# EAGLE design fabftdi-mega8 (EAGLE 8.2.2)
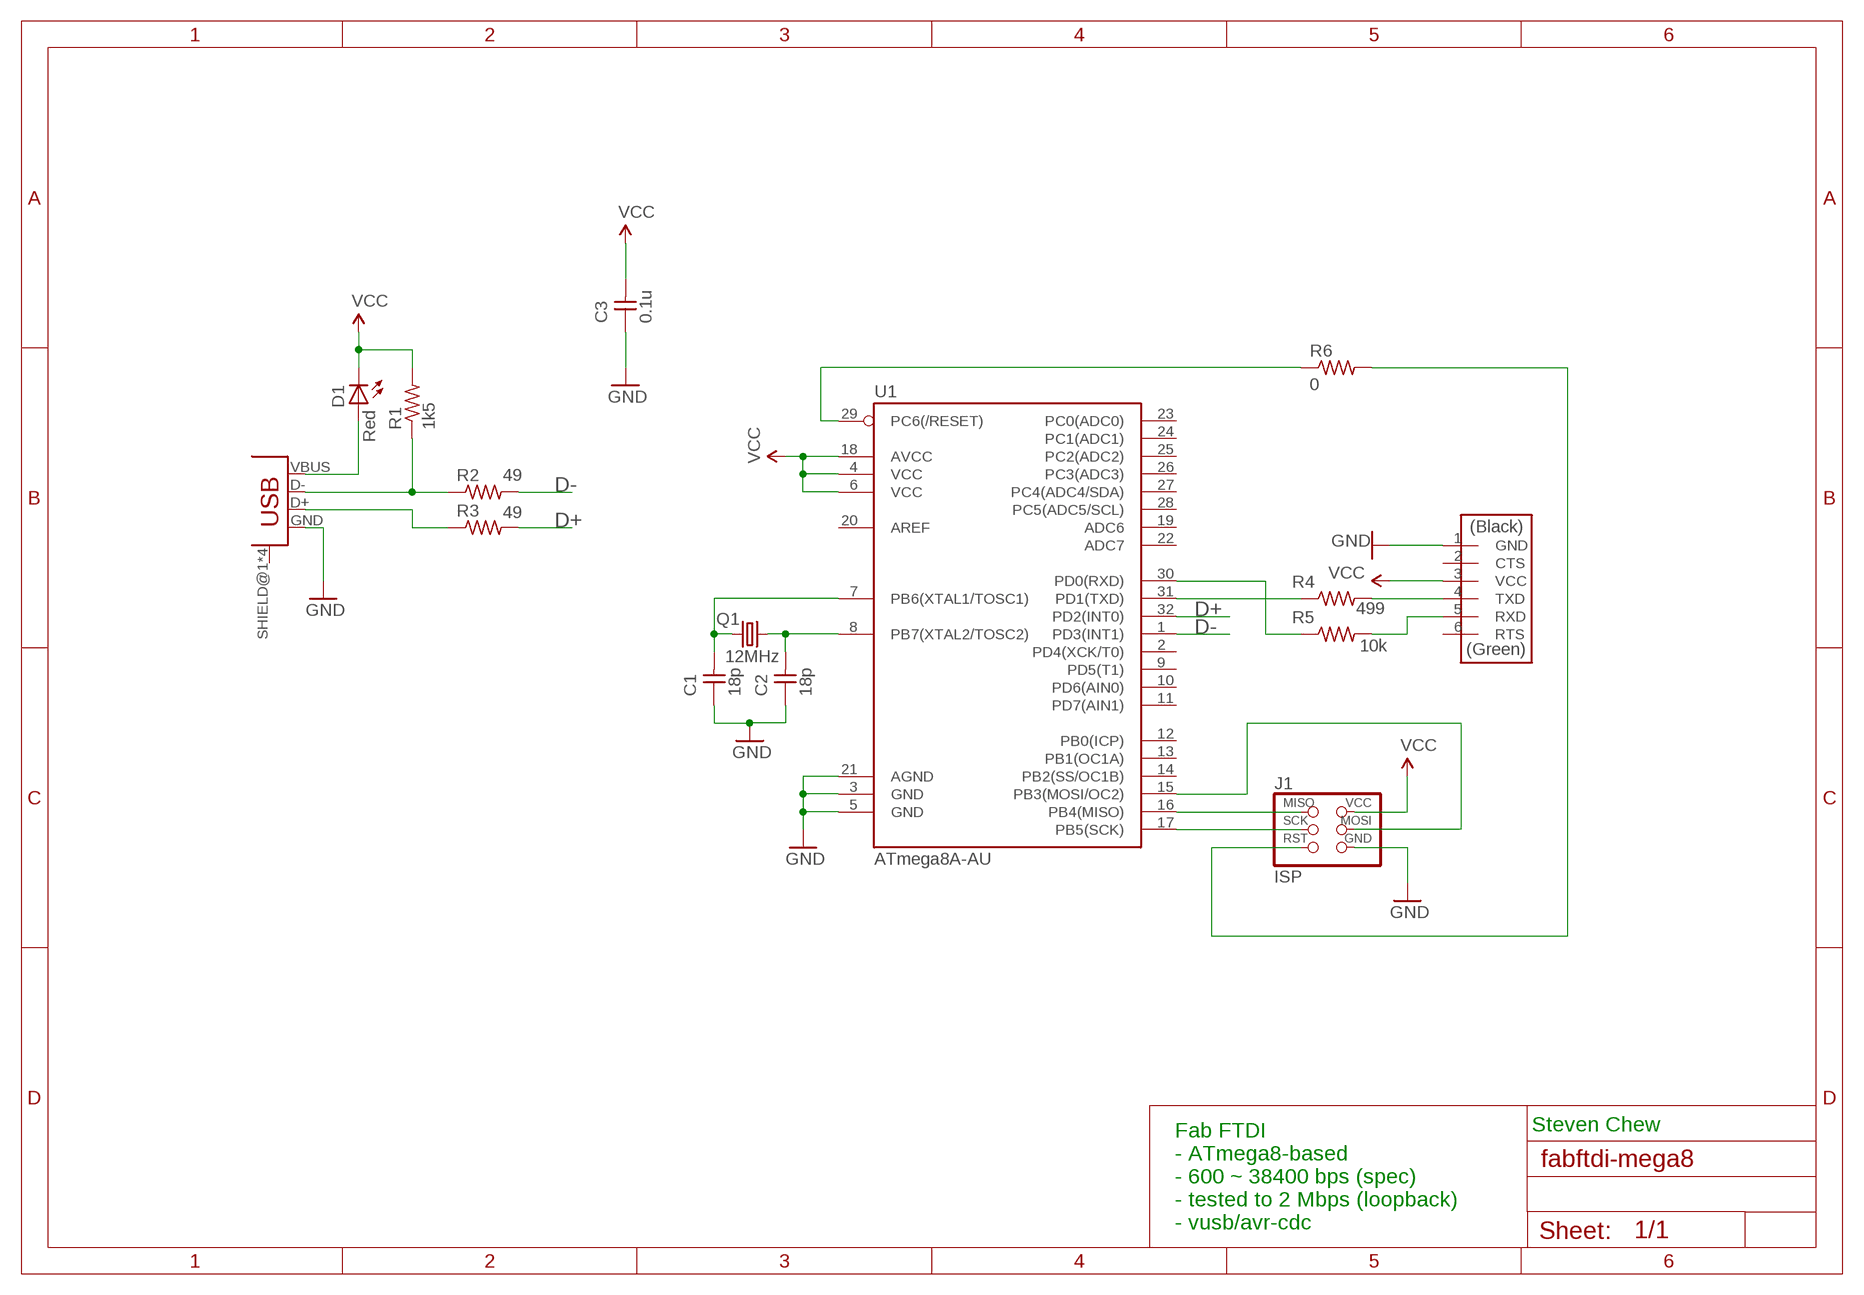
[diagram p0: schematic, sheet 1]

## Parts
C1  18p  CAP-UNPOLARIZEDFAB  [C1206FAB]
C2  18p  CAP-UNPOLARIZEDFAB  [C1206FAB]
C3  0.1u  CAP-UNPOLARIZEDFAB  [C1206FAB]
D1  Red  LEDFAB1206  [LED1206FAB]
J1  ISP  AVRISPSMD  [2X03SMD]
J2  FTDI-SMD-HEADER  [1X06SMD]
Q1  12MHz  CRYSTALHC49UP  [HC49UP]
R1  1k5  RES-US1206FAB  [R1206FAB]
R2  49  RES-US1206FAB  [R1206FAB]
R3  49  RES-US1206FAB  [R1206FAB]
R4  499  RES-US1206FAB  [R1206FAB]
R5  10k  RES-US1206FAB  [R1206FAB]
R6  0  RES-US1206FAB  [R1206FAB]
U1  ATmega8A-AU  ATMEGA328P_TQFPTQFP32-08THIN  [TQFP32-08THIN]
U2  USB_MINI  [USB_MINI]

## Nets
D+: R3.2 U1.32(PD2(INT0))
D-: R2.2 U1.1(PD3(INT1))
GND: C1.1 C2.1 C3.1 J1.6(GND) J2.1(GND) U1.3(GND) U1.5(GND) U1.21(AGND) U2.GND
N$1: C2.2 Q1.2 U1.8(PB7(XTAL2/TOSC2))
N$2: C1.2 Q1.1 U1.7(PB6(XTAL1/TOSC1))
N$3: R4.1 U1.31(PD1(TXD))
N$4: R5.1 U1.30(PD0(RXD))
N$5: J1.1(MISO) U1.16(PB4(MISO))
N$6: D1.1(A) U2.VBUS
N$7: R1.1 R2.1 U2.D-
N$8: R3.1 U2.D+
N$9: J1.3(SCK) U1.17(PB5(SCK))
N$10: J1.4(MOSI) U1.15(PB3(MOSI/OC2))
N$11: J2.4(TXD) R4.2
N$12: J1.5(RST) R6.2
N$13: R6.1 U1.29(PC6(/RESET))
N$14: J2.5(RXD) R5.2
VCC: C3.2 D1.2(C) J1.2(VCC) J2.3(VCC) R1.2 U1.4(VCC) U1.6(VCC) U1.18(AVCC)
Unconnected: J2.2(CTS) J2.6(RTS) U1.2(PD4(XCK/T0)) U1.9(PD5(T1)) U1.10(PD6(AIN0)) U1.11(PD7(AIN1)) U1.12(PB0(ICP)) U1.13(PB1(OC1A)) U1.14(PB2(SS/OC1B)) U1.19(ADC6) U1.20(AREF) U1.22(ADC7) U1.23(PC0(ADC0)) U1.24(PC1(ADC1)) U1.25(PC2(ADC2)) U1.26(PC3(ADC3)) U1.27(PC4(ADC4/SDA)) U1.28(PC5(ADC5/SCL)) U2.SHIELD@1(SHIELD) U2.SHIELD@2(SHIELD) U2.SHIELD@3(SHIELD) U2.SHIELD@4(SHIELD)

## Notes on the sheet
- Steven Chew
- Fab FTDI
  - ATmega8-based
  - 600 ~ 38400 bps (spec)
  - tested to 2 Mbps (loopback)
  - vusb/avr-cdc

## Library data of the parts
C1-C3 = 00fab:CAP-UNPOLARIZED
D1 = 00fab:LED: LED
J1 = 00fab:AVRISP
J2 = 00fab:FTDI-SMD-HEADER
Q1 = crystal:CRYSTAL: CRYSTAL; OC_FARNELL: unknown; OC_NEWARK: unknown
R1-R6 = 00fab:RES-US: Resistor (US Symbol) Variants with postfix FAB are widened to allow the routing of internal traces
U1 = 00fab:ATMEGA328P_TQFP
U2 = 00fab:USB_MINI

## Board
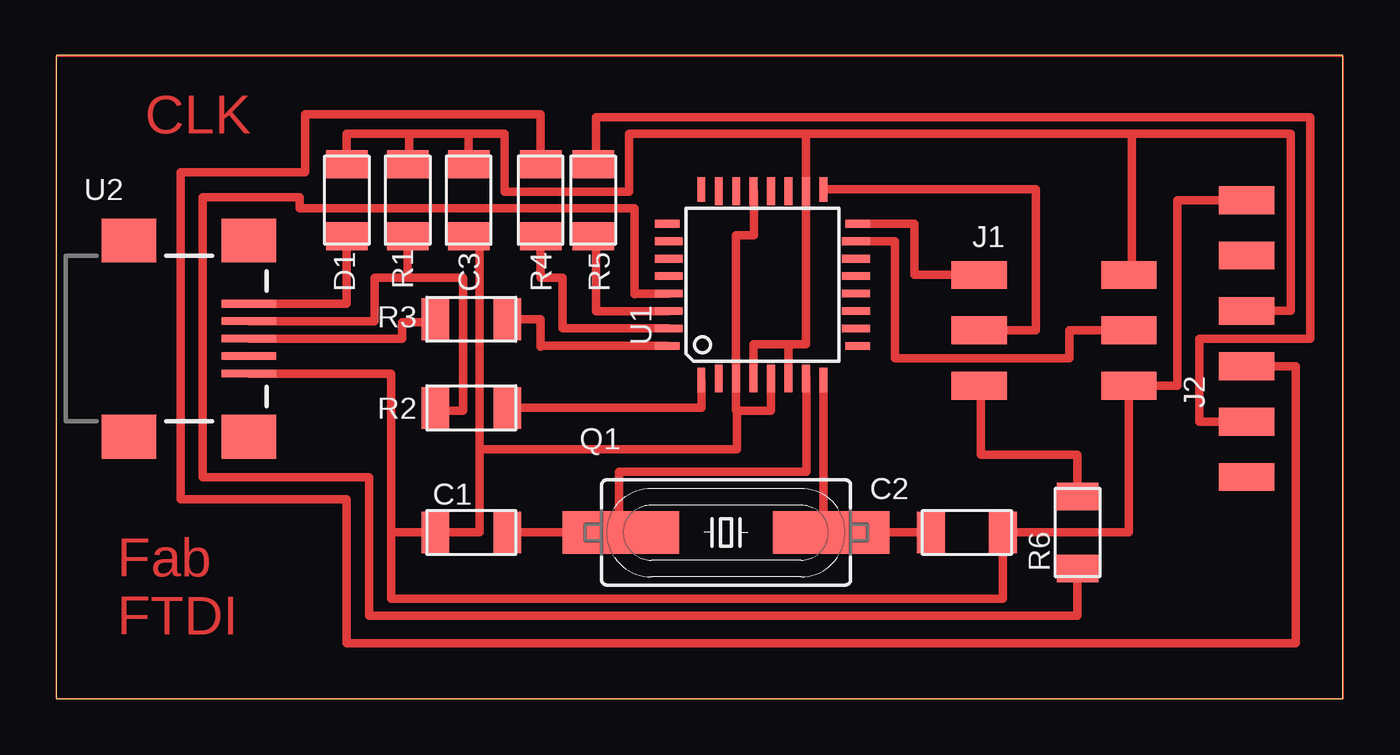
[diagram p1: board, top side]

Size 59.03 x 29.52 mm. Coordinates in mm from the lower left corner, seen from the top.
Outline: 0,0 59.03,0 59.03,29.52 0,29.52 0,0
Copper layers (1*16): Top 0.035mm / dielectric 1.5mm / Bottom 0.035mm
Design rules "default *": minimum track width 6mil, minimum drill 0.35mm, track to track 12mil, track to pad 10mil, pad to pad 10mil, via to via 6mil, smd to smd 8mil, copper to edge 40mil, drill to drill 6mil, minimum pad ring 10mil, minimum via ring 8mil, stop-mask expansion 4mil, vias tented up to drill 0mil, thermal gap 10mil

### Footprints (pad centres in the part's own frame; a part is rotated, then mirrored left to right if it is on the bottom)
C1206FAB = smd 1.27 x 1.905: 1 -1.651,0; 2 1.651,0
LED1206FAB = smd 1.27 x 1.905: 1 -1.651,0; 2 1.651,0
2X03SMD = smd 2.54 x 1.27: 1 -3.493,2.54; 2 3.365,2.54; 3 -3.493,0; 4 3.365,0; 5 -3.493,-2.54; 6 3.365,-2.54
1X06SMD = smd 2.54 x 1.27: 1 0,6.35; 2 0,3.81; 3 0,1.27; 4 0,-1.27; 5 0,-3.81; 6 0,-6.35
HC49UP = smd 5.334 x 1.93: 1 -4.826,0; 2 4.826,0
R1206FAB = smd 1.27 x 1.905: 1 -1.651,0; 2 1.651,0
TQFP32-08THIN = smd 1.118 x 0.356: 1 -4.369,2.8; 8 -4.369,-2.8; 17 4.369,-2.8; 24 4.369,2.8 | smd 1.27 x 0.356: 2 -4.293,2; 3 -4.293,1.2; 4 -4.293,0.4; 5 -4.293,-0.4; 6 -4.293,-1.2; 7 -4.293,-2; 18 4.293,-2; 19 4.293,-1.2; 20 4.293,-0.4; 21 4.293,0.4; 22 4.293,1.2; 23 4.293,2 | smd 0.356 x 1.118: 9 -2.8,-4.369; 16 2.8,-4.369; 25 2.8,4.369; 32 -2.8,4.369 | smd 0.356 x 1.27: 10 -2,-4.293; 14 1.2,-4.293; 15 2,-4.293; 26 2,4.293; 27 1.2,4.293; 31 -2,4.293 | smd 0.35 x 1.27: 11 -1.2,-4.293; 12 -0.4,-4.293; 13 0.4,-4.293; 28 0.4,4.293; 29 -0.4,4.293; 30 -1.2,4.293
USB_MINI = smd 2.5 x 0.35: D+ 3.77,0; D- 3.77,0.8; GND 3.77,-1.6; ID 3.77,-0.8; VBUS 3.77,1.6 | smd 2.5 x 2: SHIELD@1 -1.73,-4.5; SHIELD@2 -1.73,4.5; SHIELD@3 3.77,4.5; SHIELD@4 3.77,-4.5

### Placement (x,y rotation side)
C1  19.05,7.62 0 top
C2  41.78,7.62 180 top
C3  18.92,22.86 90 top
D1  13.34,22.86 90 top
J1  45.85,16.89 0 top
J2  54.61,16.51 0 top
Q1  30.73,7.62 0 top
R1  16.13,22.86 90 top
R2  19.05,13.34 0 top
R3  19.05,17.4 0 top
R4  22.23,22.86 90 top
R5  24.64,22.86 90 top
R6  46.86,7.62 90 top
U1  32.4,18.98 90 top
U2  5.08,16.51 0 top

### Tracks (layer width: path | path; a pad name or v marks a point on that pad's centre or on a via)
D+
  Top 0.381: R3.2 22.23,17.4 22.23,16.13 22.23,16.18 U1.32
D-
  Top 0.381: U1.1 29.6,13.34 R2.2
GND
  Top 0.381: U1.21 32.02,23.27 32.02,21.26 31.2,21.26 U1.3 31.2,13.21 31.24,13.21 | C3.1 19.43,21.34 19.43,11.43 | 19.43,11.43 19.43,7.62 C1.1 15.37,7.62 | 31.24,13.21 31.24,11.43 19.43,11.43 | U2.GND 15.37,14.91 15.37,7.62 | 15.37,7.62 15.37,4.57 43.43,4.57 C2.1 49.21,7.62 J1.6 51.44,14.35 51.44,22.86 J2.1 | U1.5 32.8,13.21 31.24,13.21
N$1
  Top 0.381: C2.2 Q1.2 | 35.43,7.75 Q1.2 | Q1.2 35.2,7.62 U1.8
N$2
  Top 0.381: 25.82,7.62 Q1.1 26.04,7.75 | 25.82,7.62 C1.2 | 25.82,7.62 25.82,10.41 34.42,10.41 34.42,14.68 U1.7
N$3
  Top 0.381: R4.1 22.23,19.3 23.24,19.3 23.24,17.22 | 23.24,17.22 23.24,17.02 | U1.31 23.24,16.98 23.24,17.22
N$4
  Top 0.381: R5.1 24.77,21.21 24.77,17.78 U1.30
N$5
  Top 0.381: J1.1 39.37,19.43 39.37,21.78 U1.16
N$6
  Top 0.381: U2.VBUS 13.34,18.11 D1.1
N$7
  Top 0.381: U2.D- 14.61,17.31 14.61,19.3 16.13,19.3 | 16.13,19.3 R1.1 | 16.13,19.3 18.67,19.3 18.67,13.21 17.4,13.21 R2.1
N$8
  Top 0.381: U2.D+ 15.88,16.51 15.88,17.27 17.4,17.27 R3.1
N$9
  Top 0.381: J1.3 44.96,16.89 44.96,23.37 35.2,23.37 U1.17
N$10
  Top 0.381: J1.4 46.48,16.89 46.48,15.62 38.48,15.62 38.48,20.98 U1.15
N$11
  Top 0.381: R4.2 22.23,26.8 11.43,26.8 11.43,24.13 5.71,24.13 5.71,9.14 13.34,9.14 13.34,2.54 56.87,2.54 56.87,15.24 J2.4
N$12
  Top 0.381: J1.5 42.42,14.35 42.42,11.18 46.86,11.18 R6.2
N$13
  Top 0.381: R6.1 46.86,3.81 14.35,3.81 14.35,10.16 6.73,10.16 6.73,22.99 11.18,22.99 11.18,22.48 26.54,22.48 26.54,18.55 | 26.54,18.55 26.54,18.54 | U1.29 26.54,18.58 26.54,18.55
N$14
  Top 0.381: R5.2 24.77,24.51 24.77,26.67 57.53,26.67 57.53,16.51 52.45,16.51 52.45,12.7 J2.5
N$15
  Top 0.076: 0,0 59.05,0 59.05,29.46 0,29.46 0,0
VCC
  Top 0.381: D1.2 13.34,25.91 16.19,25.91 | 16.19,25.91 18.92,25.91 | 18.92,25.91 C3.2 | R1.2 16.19,24.51 16.19,25.91 | J1.2 49.35,19.43 49.35,25.91 | 34.41,25.91 49.35,25.91 | 34.41,25.91 U1.18 34.4,16.26 33.53,16.26 | 18.92,25.91 20.57,25.91 20.57,23.24 26.29,23.24 26.29,25.91 34.41,25.91 | 49.35,25.91 56.64,25.91 56.64,17.78 J2.3 | U1.4 32,16.26 33.53,16.26 | 33.53,16.26 33.6,16.26 U1.6

### Text on the board
Top: CLK | Fab / FTDI